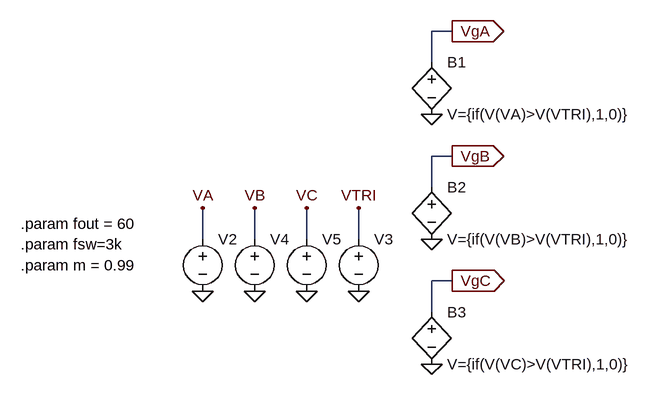
[diagram p0: schematic 3ph PWM Gen.asc]
3ph PWM Gen.asc, the LTspice schematic file:
Version 4
SHEET 1 1528 800
WIRE -160 -64 -192 -64
WIRE -192 -16 -192 -64
WIRE -160 128 -192 128
WIRE -192 176 -192 128
WIRE -544 256 -544 208
WIRE -464 256 -464 208
WIRE -384 256 -384 208
WIRE -304 256 -304 208
WIRE -160 320 -192 320
WIRE -192 368 -192 320
FLAG -544 336 0
FLAG -464 336 0
FLAG -384 336 0
FLAG -304 336 0
FLAG -160 -64 VgA
IOPIN -160 -64 Out
FLAG -160 128 VgB
IOPIN -160 128 Out
FLAG -160 320 VgC
IOPIN -160 320 Out
FLAG -544 208 VA
FLAG -464 208 VB
FLAG -384 208 VC
FLAG -304 208 VTRI
FLAG -192 64 0
FLAG -192 256 0
FLAG -192 448 0
SYMBOL voltage -544 240 R0
WINDOW 3 24 104 Invisible 2
WINDOW 123 0 0 Left 2
WINDOW 39 0 0 Left 2
SYMATTR Value SINE(0 {m} {fout} 0 0 0)
SYMATTR InstName V2
SYMBOL voltage -304 240 R0
WINDOW 123 0 0 Left 2
WINDOW 39 0 0 Left 2
WINDOW 3 24 104 Invisible 2
SYMATTR Value PULSE(-1 1 0 {1/(2*fsw)} {1/(2*fsw)} 0 {1/fsw})
SYMATTR InstName V3
SYMBOL voltage -464 240 R0
WINDOW 3 24 104 Invisible 2
WINDOW 123 0 0 Left 2
WINDOW 39 0 0 Left 2
SYMATTR Value SINE(0 {m} {fout} 0 0 120)
SYMATTR InstName V4
SYMBOL voltage -384 240 R0
WINDOW 3 24 104 Invisible 2
WINDOW 123 0 0 Left 2
WINDOW 39 0 0 Left 2
SYMATTR Value SINE(0 {m} {fout} 0 0 240)
SYMATTR InstName V5
SYMBOL bv -192 -32 R0
SYMATTR InstName B1
SYMATTR Value V={if(V(VA)>V(VTRI),1,0)}
SYMBOL bv -192 160 R0
SYMATTR InstName B2
SYMATTR Value V={if(V(VB)>V(VTRI),1,0)}
SYMBOL bv -192 352 R0
SYMATTR InstName B3
SYMATTR Value V={if(V(VC)>V(VTRI),1,0)}
TEXT -824 232 Left 2 !.param fout = 60
TEXT -824 264 Left 2 !.param fsw=3k
TEXT -824 296 Left 2 !.param m = 0.99

The netlist it stands for:
* 3ph PWM Gen.asc
V2 VA 0 SINE(0 {m} {fout} 0 0 0)
V3 VTRI 0 PULSE(-1 1 0 {1/(2*fsw)} {1/(2*fsw)} 0 {1/fsw})
V4 VB 0 SINE(0 {m} {fout} 0 0 120)
V5 VC 0 SINE(0 {m} {fout} 0 0 240)
B1 VgA 0 V={if(V(VA)>V(VTRI),1,0)}
B2 VgB 0 V={if(V(VB)>V(VTRI),1,0)}
B3 VgC 0 V={if(V(VC)>V(VTRI),1,0)}
.param fout = 60
.param fsw=3k
.param m = 0.99
.backanno
.end